# Altium schematic sheet [07] - DOC REVISION HISTORY.SchDoc
size A3; DocumentNumber: 7; SheetNumber: 7; SheetTotal: 8
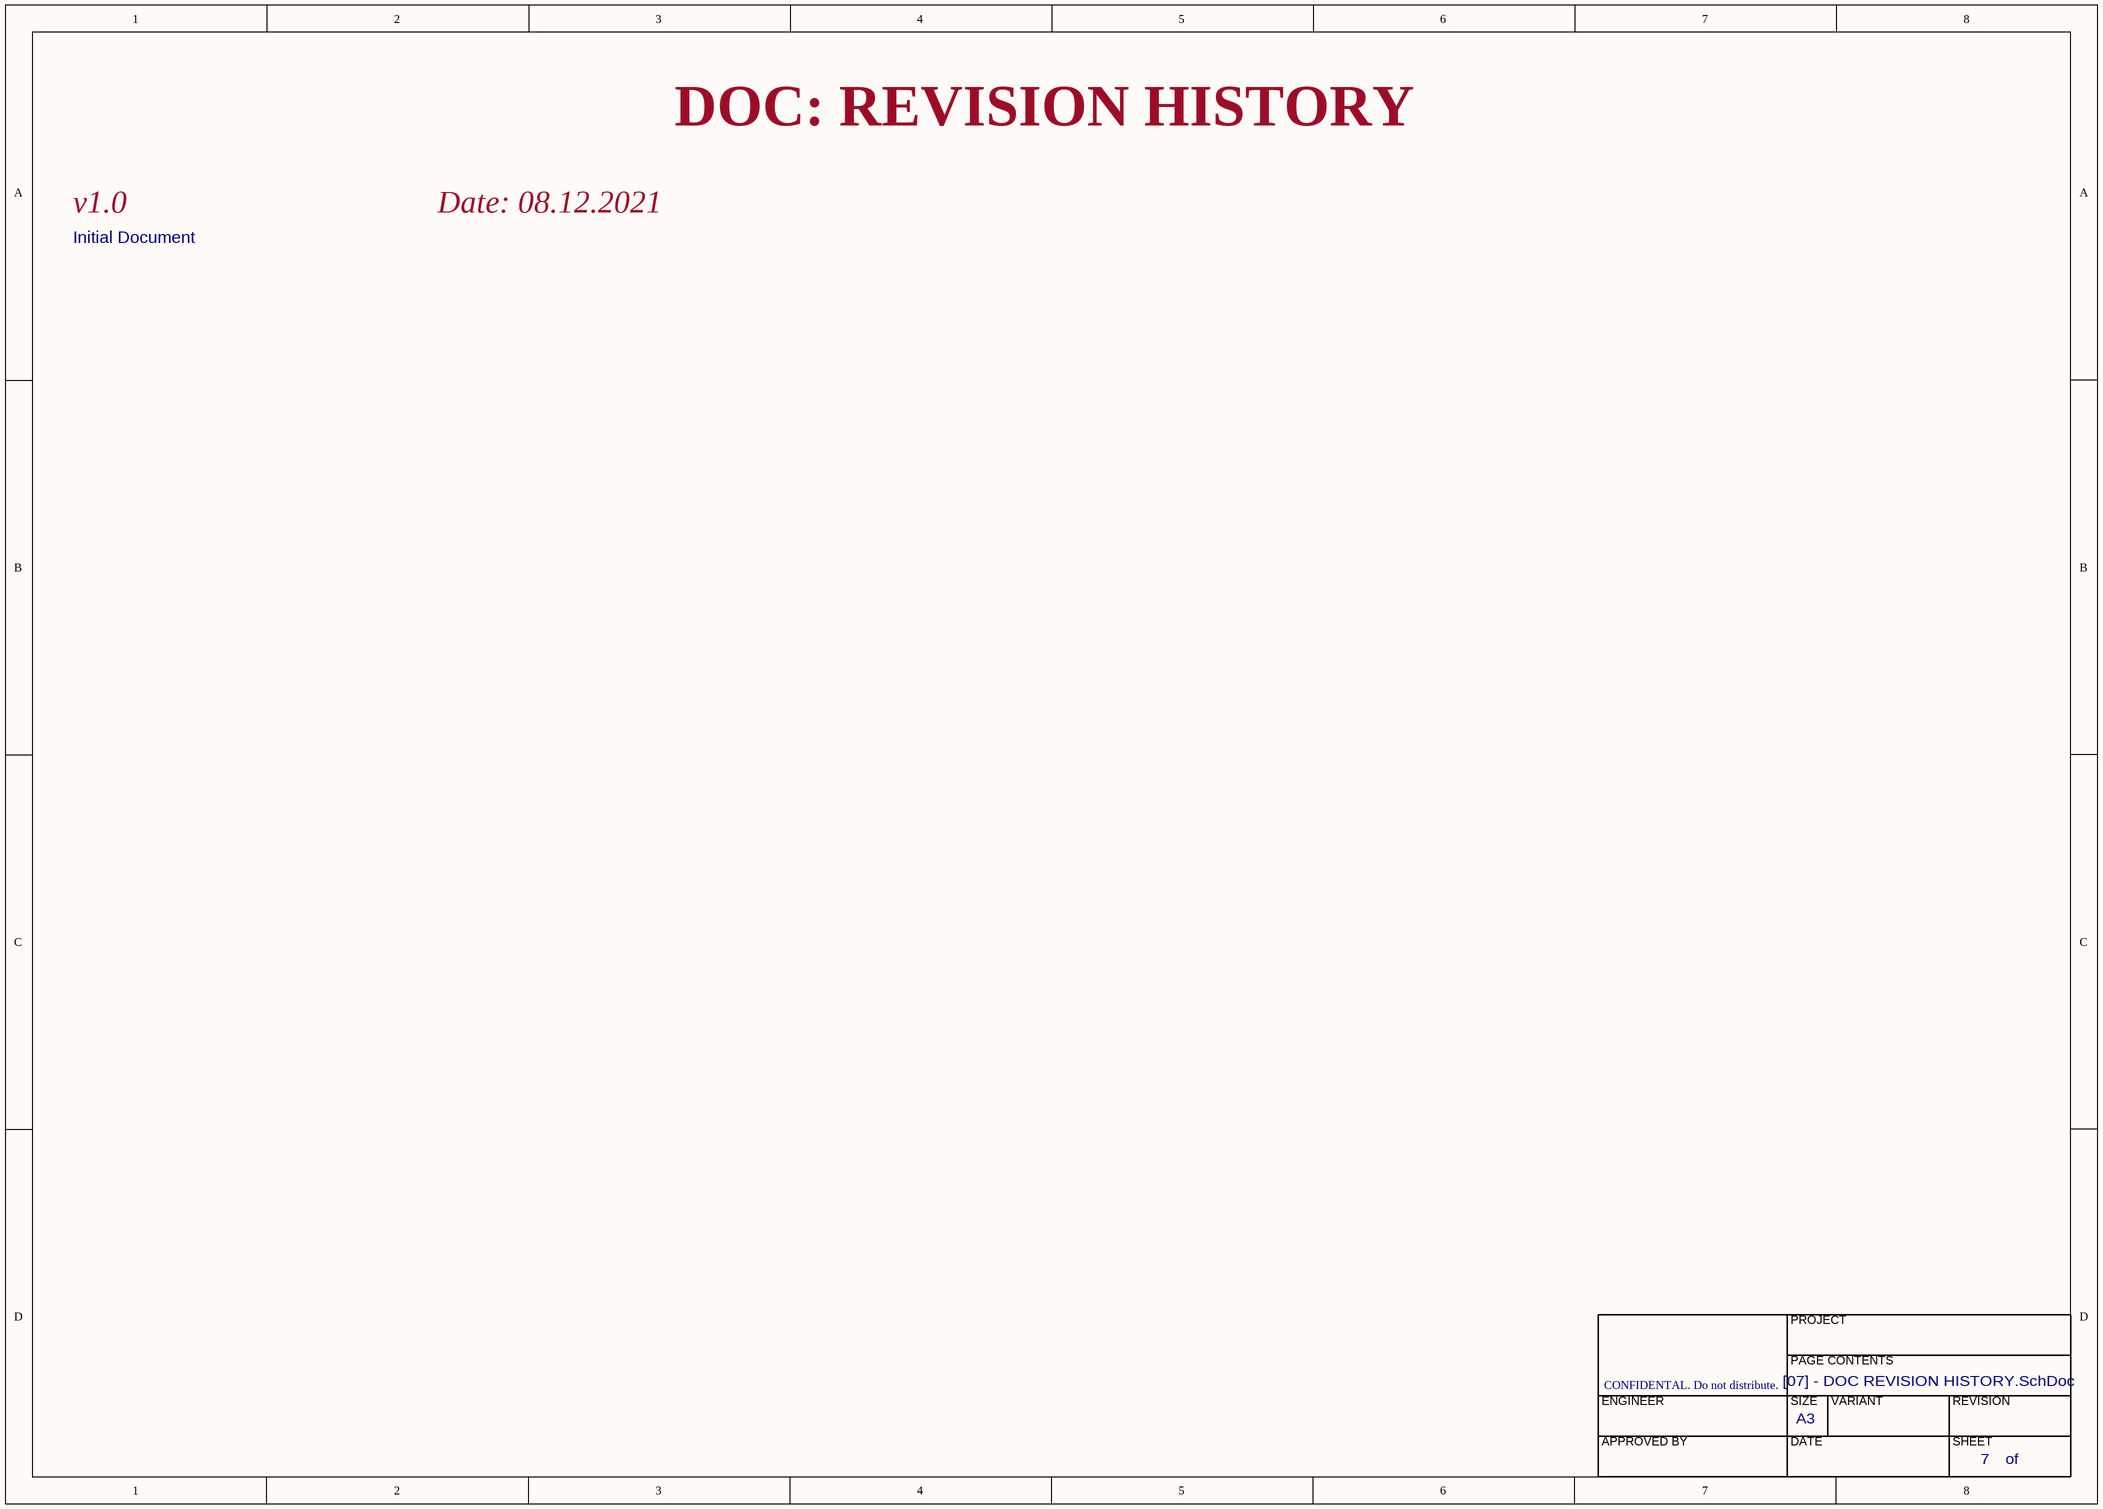
[diagram p0: [07] - DOC REVISION HISTORY.SchDoc]

## Notes on the sheet
- DOC: REVISION HISTORY
- Initial Document
- v1.0
- Date: 08.12.2021
- PROJECT
- CLOCKS (CPU & PCIE)
- CONFIDENTAL. Do not distribute.
- PAGE CONTENTS
- ENGINEER
- APPROVED BY
- SIZE
- DATE
- A3
- VARIANT
- REVISION
- SHEET
- of